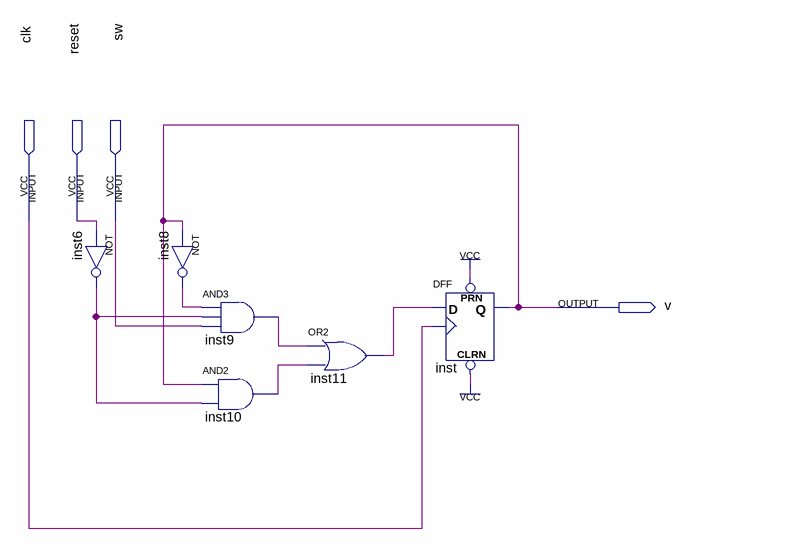
[diagram p0: schematic sheet]
// Quartus schematic sword.bdf as structural Verilog: 6 symbols, 4 pins
module sword (
  input  clk,
  input  reset,
  input  sw,
  output v
);

  wire inst6_out, inst8_out, inst9_out, inst10_out, inst11_out;

  not inst6 (inst6_out, reset);
  not inst8 (inst8_out, v);
  and inst9 (inst9_out, inst8_out, inst6_out, sw);
  and inst10 (inst10_out, v, inst6_out);
  or inst11 (inst11_out, inst9_out, inst10_out);
  DFF inst (.CLRN(1'b1), .CLK(clk), .D(inst11_out), .PRN(1'b1), .Q(v));
endmodule
